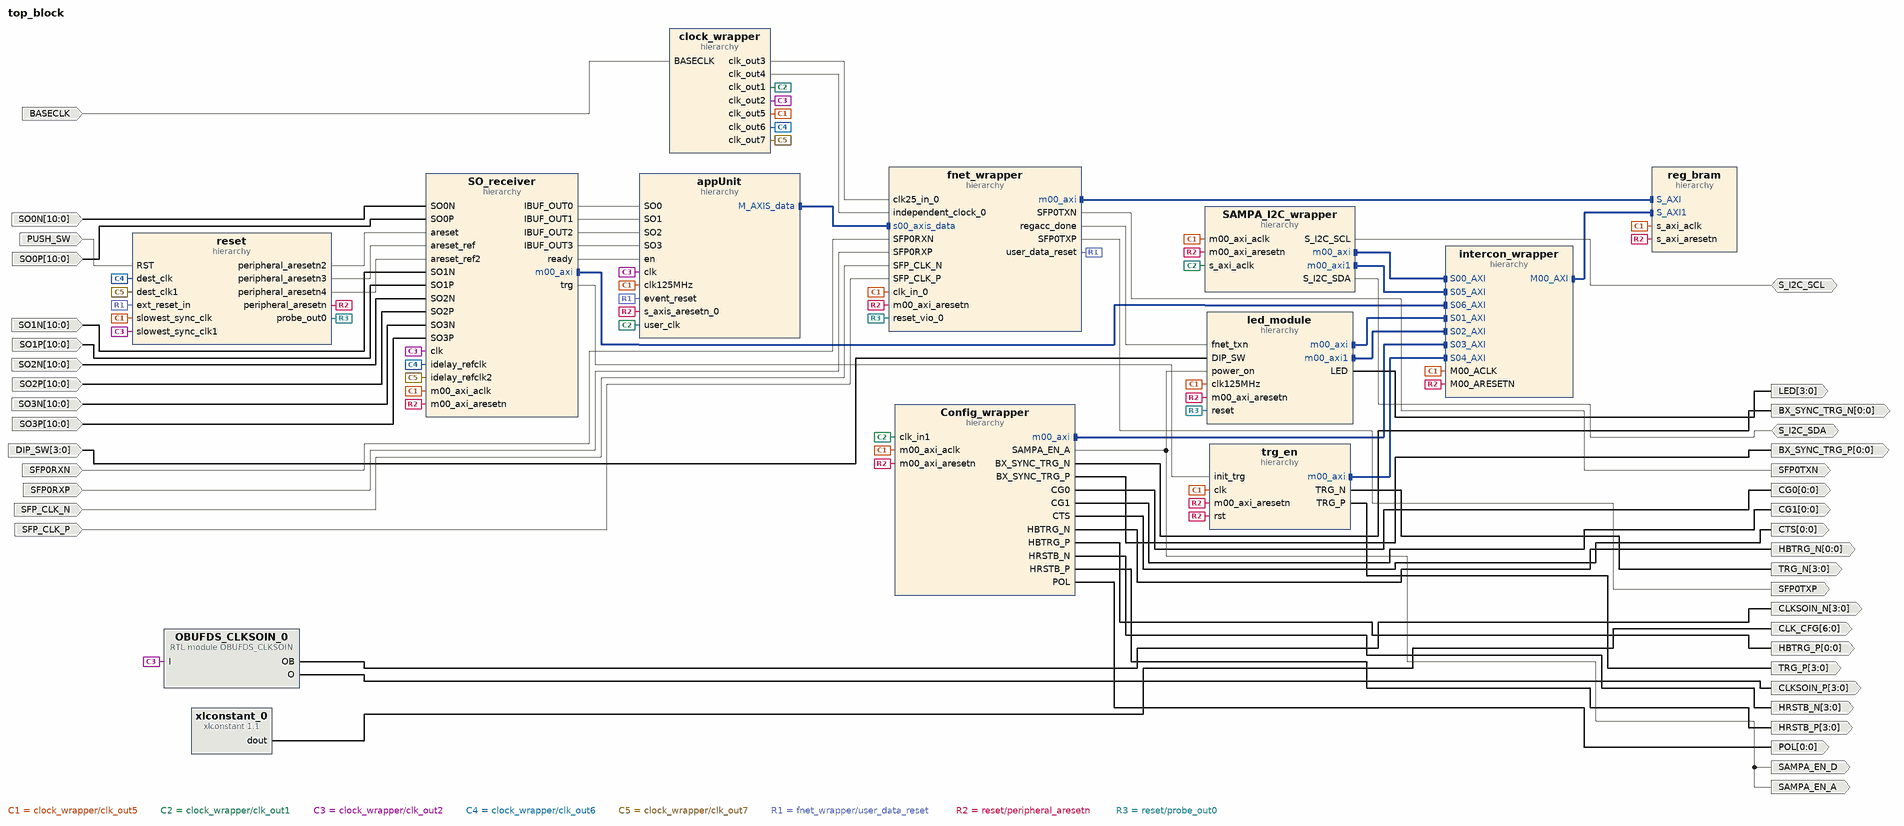
[diagram p0: block diagram of the top level]
# Vivado block design top_block, xcau15p-sbvb484-1-i, Vivado 2022.2
create_bd_design top_block

create_bd_port -dir I SFP0RXN
create_bd_port -dir O SFP0TXP
create_bd_port -dir I SFP_CLK_P
create_bd_port -dir I SFP_CLK_N
create_bd_port -dir O SFP0TXN
create_bd_port -dir I SFP0RXP
create_bd_port -dir I -type clk BASECLK
set_property -dict {CONFIG.FREQ_HZ 40000000} [get_bd_ports BASECLK]
create_bd_port -dir O -from 3 -to 0 LED
create_bd_port -dir I -from 10 -to 0 -type data SO1P
create_bd_port -dir I -from 10 -to 0 -type data SO1N
create_bd_port -dir I -from 10 -to 0 -type data SO0N
create_bd_port -dir I -from 10 -to 0 -type data SO0P
create_bd_port -dir I -from 10 -to 0 -type data SO2N
create_bd_port -dir I -from 10 -to 0 -type data SO2P
create_bd_port -dir I -from 10 -to 0 -type data SO3N
create_bd_port -dir I -from 10 -to 0 -type data SO3P
create_bd_port -dir O -from 3 -to 0 TRG_N
create_bd_port -dir O -from 3 -to 0 TRG_P
create_bd_port -dir O SAMPA_EN_A
create_bd_port -dir O SAMPA_EN_D
create_bd_port -dir O -from 6 -to 0 CLK_CFG
create_bd_port -dir O -from 3 -to 0 -type clk CLKSOIN_P
create_bd_port -dir O -from 3 -to 0 -type clk CLKSOIN_N
create_bd_port -dir I -type rst PUSH_SW
create_bd_port -dir IO S_I2C_SDA
create_bd_port -dir IO S_I2C_SCL
create_bd_port -dir O -from 0 -to 0 BX_SYNC_TRG_P
create_bd_port -dir O -from 0 -to 0 BX_SYNC_TRG_N
create_bd_port -dir O -from 0 -to 0 HBTRG_P
create_bd_port -dir O -from 0 -to 0 HBTRG_N
create_bd_port -dir O -from 3 -to 0 HRSTB_N
create_bd_port -dir O -from 3 -to 0 HRSTB_P
create_bd_port -dir O -from 0 -to 0 CTS
create_bd_port -dir O -from 0 -to 0 POL
create_bd_port -dir O -from 0 -to 0 CG0
create_bd_port -dir O -from 0 -to 0 CG1
create_bd_port -dir I -from 3 -to 0 DIP_SW

create_bd_cell -type hier led_module
create_bd_cell -type hier reset
create_bd_cell -type hier reg_bram
create_bd_cell -type hier SAMPA_I2C_wrapper
create_bd_cell -type ip -vlnv xilinx.com:ip:xlconstant:1.1 xlconstant_0
set_property -dict {CONFIG.CONST_VAL 0b1010011 CONFIG.CONST_WIDTH 7} [get_bd_cells xlconstant_0]
create_bd_cell -type hier appUnit
create_bd_cell -type hier fnet_wrapper
create_bd_cell -type hier clock_wrapper
create_bd_cell -type hier SO_receiver
create_bd_cell -type hier trg_en
create_bd_cell -type hier Config_wrapper
create_bd_cell -type hier intercon_wrapper
create_bd_cell -type module -reference OBUFDS_CLKSOIN OBUFDS_CLKSOIN_0

# ---- hierarchy /led_module ----
current_bd_instance /led_module
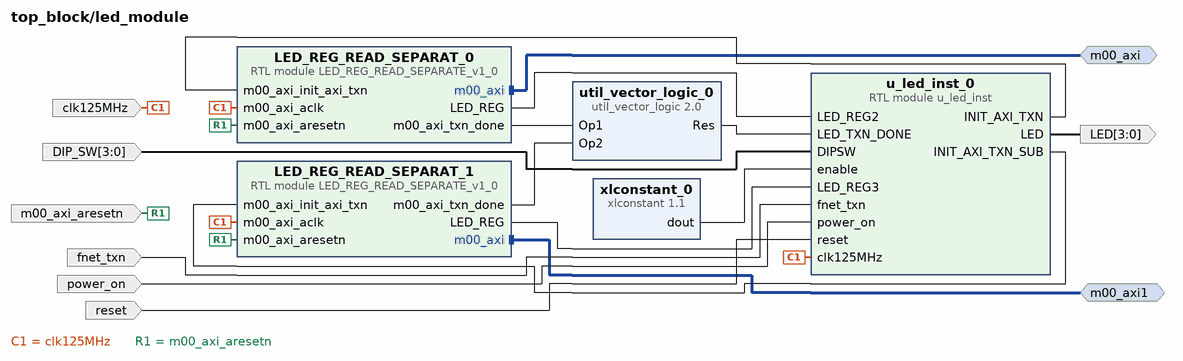
[diagram p1: block diagram inside /led_module]
create_bd_intf_pin -mode Master -vlnv xilinx.com:interface:aximm_rtl:1.0 m00_axi
create_bd_intf_pin -mode Master -vlnv xilinx.com:interface:aximm_rtl:1.0 m00_axi1
create_bd_pin -dir I -type rst reset
create_bd_pin -dir O -from 3 -to 0 LED
create_bd_pin -dir I clk125MHz
create_bd_pin -dir I -type rst m00_axi_aresetn
create_bd_pin -dir I fnet_txn
create_bd_pin -dir I power_on
create_bd_pin -dir I -from 3 -to 0 DIP_SW

create_bd_cell -type ip -vlnv xilinx.com:ip:util_vector_logic:2.0 util_vector_logic_0
set_property -dict {CONFIG.C_OPERATION or CONFIG.C_SIZE 1} [get_bd_cells util_vector_logic_0]
create_bd_cell -type ip -vlnv xilinx.com:ip:xlconstant:1.1 xlconstant_0
create_bd_cell -type module -reference LED_REG_READ_SEPARATE_v1_0 LED_REG_READ_SEPARAT_0
set_property -dict [list \
  CONFIG.C_M00_AXI_TARGET_SLAVE_BASE_ADDR 0xC0000000 \
  CONFIG.LED_ADDRESS 0x00000F02 \
] [get_bd_cells LED_REG_READ_SEPARAT_0]
create_bd_cell -type module -reference LED_REG_READ_SEPARATE_v1_0 LED_REG_READ_SEPARAT_1
set_property -dict [list \
  CONFIG.C_M00_AXI_TARGET_SLAVE_BASE_ADDR 0xC0000000 \
  CONFIG.LED_ADDRESS 0x00000F03 \
] [get_bd_cells LED_REG_READ_SEPARAT_1]
create_bd_cell -type module -reference u_led_inst u_led_inst_0

# ---- hierarchy /reset ----
current_bd_instance /reset
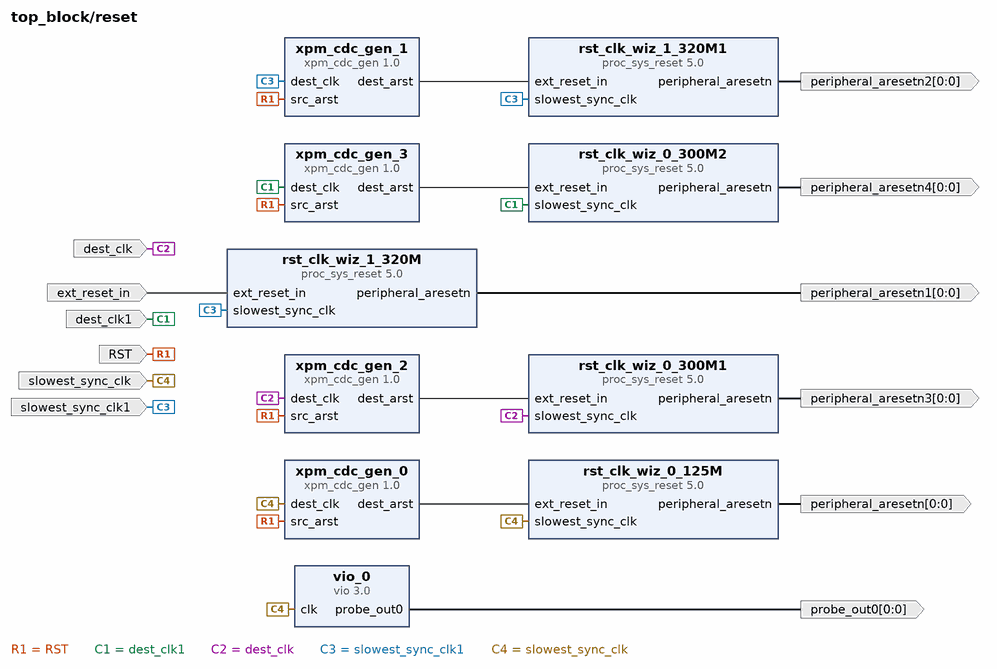
[diagram p2: block diagram inside /reset]
create_bd_pin -dir O -from 0 -to 0 probe_out0
create_bd_pin -dir I -type clk slowest_sync_clk
create_bd_pin -dir O -from 0 -to 0 -type rst peripheral_aresetn
create_bd_pin -dir I RST
create_bd_pin -dir I -type clk slowest_sync_clk1
create_bd_pin -dir O -from 0 -to 0 -type rst peripheral_aresetn1
create_bd_pin -dir I -type rst ext_reset_in
create_bd_pin -dir O -from 0 -to 0 -type rst peripheral_aresetn2
create_bd_pin -dir O -from 0 -to 0 -type rst peripheral_aresetn3
create_bd_pin -dir I -type clk dest_clk
create_bd_pin -dir I -type clk dest_clk1
create_bd_pin -dir O -from 0 -to 0 -type rst peripheral_aresetn4

create_bd_cell -type ip -vlnv xilinx.com:ip:vio:3.0 vio_0
set_property -dict {CONFIG.C_NUM_PROBE_IN 0} [get_bd_cells vio_0]
create_bd_cell -type ip -vlnv xilinx.com:ip:proc_sys_reset:5.0 rst_clk_wiz_0_125M
create_bd_cell -type ip -vlnv xilinx.com:ip:xpm_cdc_gen:1.0 xpm_cdc_gen_0
set_property -dict {CONFIG.CDC_TYPE xpm_cdc_async_rst CONFIG.DEST_SYNC_FF 8} [get_bd_cells xpm_cdc_gen_0]
create_bd_cell -type ip -vlnv xilinx.com:ip:proc_sys_reset:5.0 rst_clk_wiz_1_320M
create_bd_cell -type ip -vlnv xilinx.com:ip:proc_sys_reset:5.0 rst_clk_wiz_1_320M1
create_bd_cell -type ip -vlnv xilinx.com:ip:xpm_cdc_gen:1.0 xpm_cdc_gen_1
set_property -dict {CONFIG.CDC_TYPE xpm_cdc_async_rst} [get_bd_cells xpm_cdc_gen_1]
create_bd_cell -type ip -vlnv xilinx.com:ip:xpm_cdc_gen:1.0 xpm_cdc_gen_2
set_property -dict {CONFIG.CDC_TYPE xpm_cdc_async_rst CONFIG.DEST_SYNC_FF 8} [get_bd_cells xpm_cdc_gen_2]
create_bd_cell -type ip -vlnv xilinx.com:ip:proc_sys_reset:5.0 rst_clk_wiz_0_300M1
create_bd_cell -type ip -vlnv xilinx.com:ip:proc_sys_reset:5.0 rst_clk_wiz_0_300M2
create_bd_cell -type ip -vlnv xilinx.com:ip:xpm_cdc_gen:1.0 xpm_cdc_gen_3
set_property -dict {CONFIG.CDC_TYPE xpm_cdc_async_rst CONFIG.DEST_SYNC_FF 8} [get_bd_cells xpm_cdc_gen_3]

# ---- hierarchy /reg_bram ----
current_bd_instance /reg_bram
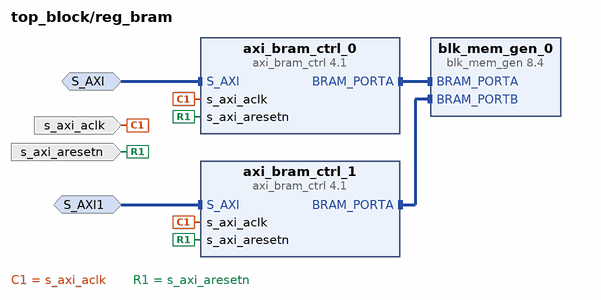
[diagram p3: block diagram inside /reg_bram]
create_bd_intf_pin -mode Slave -vlnv xilinx.com:interface:aximm_rtl:1.0 S_AXI
create_bd_intf_pin -mode Slave -vlnv xilinx.com:interface:aximm_rtl:1.0 S_AXI1
create_bd_pin -dir I -type rst s_axi_aresetn
create_bd_pin -dir I -type clk s_axi_aclk

create_bd_cell -type ip -vlnv xilinx.com:ip:axi_bram_ctrl:4.1 axi_bram_ctrl_0
set_property -dict {CONFIG.PROTOCOL AXI4LITE CONFIG.SINGLE_PORT_BRAM 1} [get_bd_cells axi_bram_ctrl_0]
create_bd_cell -type ip -vlnv xilinx.com:ip:blk_mem_gen:8.4 blk_mem_gen_0
set_property -dict {CONFIG.Memory_Type True_Dual_Port_RAM} [get_bd_cells blk_mem_gen_0]
create_bd_cell -type ip -vlnv xilinx.com:ip:axi_bram_ctrl:4.1 axi_bram_ctrl_1
set_property -dict {CONFIG.PROTOCOL AXI4LITE CONFIG.SINGLE_PORT_BRAM 1} [get_bd_cells axi_bram_ctrl_1]

# ---- hierarchy /SAMPA_I2C_wrapper ----
current_bd_instance /SAMPA_I2C_wrapper
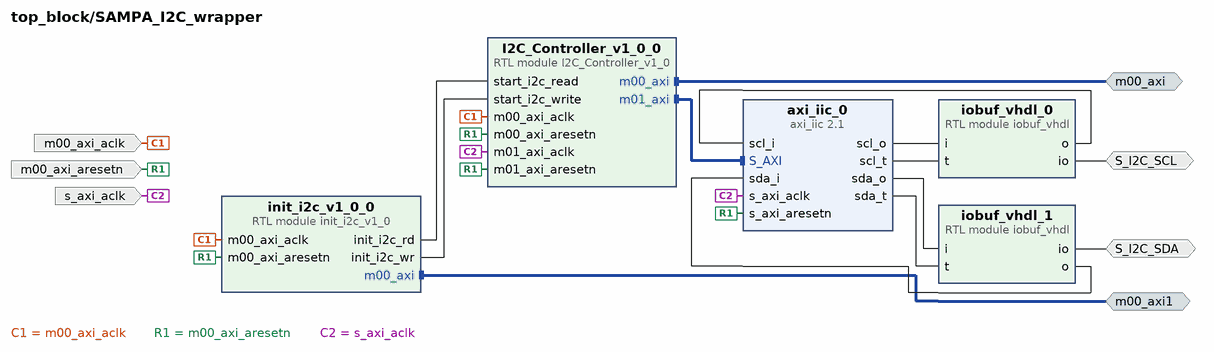
[diagram p4: block diagram inside /SAMPA_I2C_wrapper]
create_bd_intf_pin -mode Master -vlnv xilinx.com:interface:aximm_rtl:1.0 m00_axi
create_bd_intf_pin -mode Master -vlnv xilinx.com:interface:aximm_rtl:1.0 m00_axi1
create_bd_pin -dir I -type rst m00_axi_aresetn
create_bd_pin -dir I -type clk m00_axi_aclk
create_bd_pin -dir I -type clk s_axi_aclk
create_bd_pin -dir IO S_I2C_SDA
create_bd_pin -dir IO S_I2C_SCL

create_bd_cell -type ip -vlnv xilinx.com:ip:axi_iic:2.1 axi_iic_0
set_property -dict {CONFIG.C_SDA_LEVEL 0 CONFIG.IIC_FREQ_KHZ 1000 CONFIG.TEN_BIT_ADR 10_bit} [get_bd_cells axi_iic_0]
create_bd_cell -type module -reference iobuf_vhdl iobuf_vhdl_0
create_bd_cell -type module -reference iobuf_vhdl iobuf_vhdl_1
create_bd_cell -type module -reference I2C_Controller_v1_0 I2C_Controller_v1_0_0
set_property -dict [list \
  CONFIG.C_M00_AXI_TARGET_SLAVE_BASE_ADDR 0xC0000000 \
  CONFIG.C_M01_AXI_TARGET_SLAVE_BASE_ADDR 0x40000000 \
] [get_bd_cells I2C_Controller_v1_0_0]
create_bd_cell -type module -reference init_i2c_v1_0 init_i2c_v1_0_0
set_property -dict [list \
  CONFIG.C_M00_AXI_TARGET_SLAVE_BASE_ADDR 0xC0000000 \
  CONFIG.TARGET_ADDRESS 0x00000400 \
  CONFIG.TXN_TIMING 0x0100000 \
] [get_bd_cells init_i2c_v1_0_0]

# ---- hierarchy /appUnit ----
current_bd_instance /appUnit
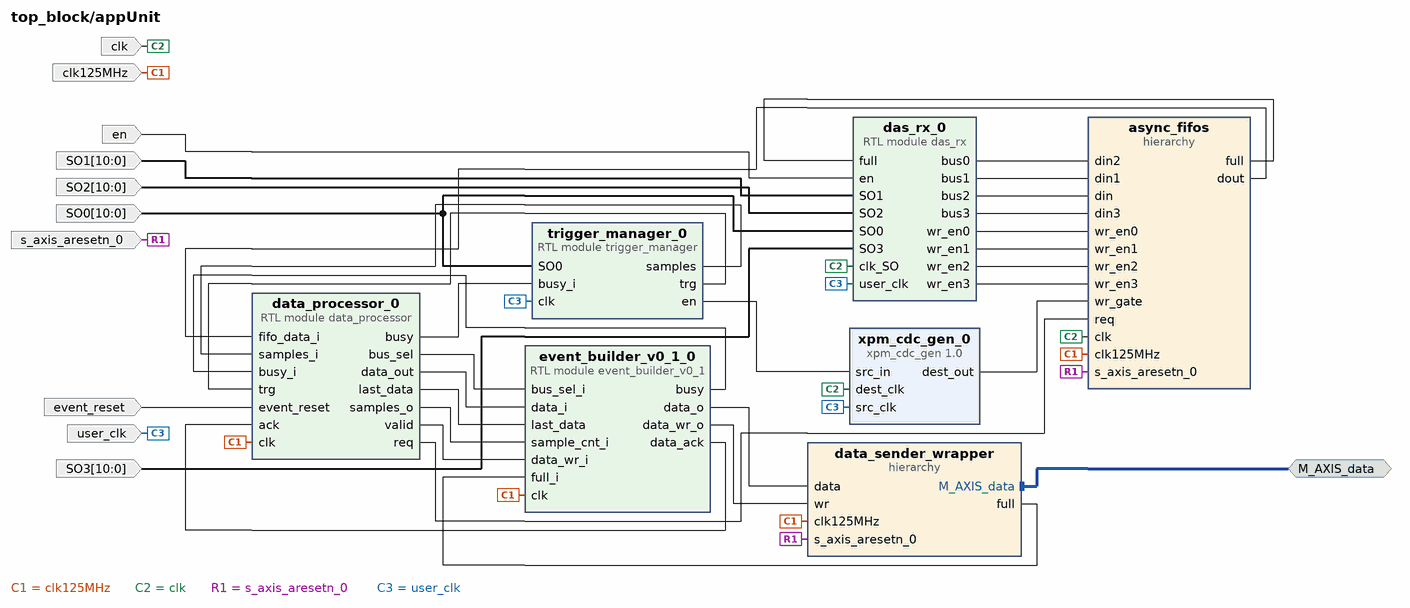
[diagram p5: block diagram inside /appUnit]
create_bd_intf_pin -mode Master -vlnv xilinx.com:interface:axis_rtl:1.0 M_AXIS_data
create_bd_pin -dir I -type clk clk
create_bd_pin -dir I -type clk user_clk
create_bd_pin -dir I -type rst event_reset
create_bd_pin -dir I -type clk clk125MHz
create_bd_pin -dir I -from 10 -to 0 SO1
create_bd_pin -dir I -from 10 -to 0 SO3
create_bd_pin -dir I -from 10 -to 0 SO2
create_bd_pin -dir I -from 10 -to 0 SO0
create_bd_pin -dir I en
create_bd_pin -dir I -type rst s_axis_aresetn_0

create_bd_cell -type ip -vlnv xilinx.com:ip:xpm_cdc_gen:1.0 xpm_cdc_gen_0
set_property -dict {CONFIG.CDC_TYPE xpm_cdc_single} [get_bd_cells xpm_cdc_gen_0]
create_bd_cell -type hier async_fifos
create_bd_cell -type hier data_sender_wrapper
create_bd_cell -type module -reference trigger_manager trigger_manager_0
create_bd_cell -type module -reference das_rx das_rx_0
create_bd_cell -type module -reference event_builder_v0_1 event_builder_v0_1_0
create_bd_cell -type module -reference data_processor data_processor_0

# ---- hierarchy /appUnit/async_fifos ----
current_bd_instance /appUnit/async_fifos
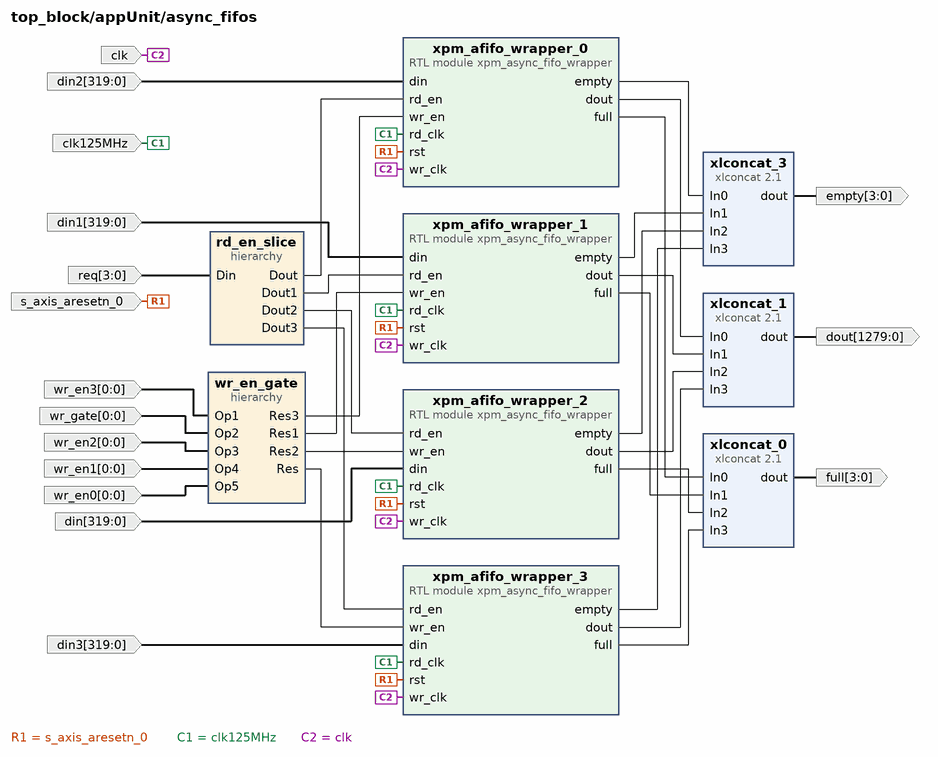
[diagram p6: block diagram inside /appUnit/async_fifos]
create_bd_pin -dir I -type clk clk125MHz
create_bd_pin -dir I -type clk clk
create_bd_pin -dir I -from 319 -to 0 din
create_bd_pin -dir I -from 319 -to 0 din1
create_bd_pin -dir I -from 319 -to 0 din2
create_bd_pin -dir I -from 319 -to 0 din3
create_bd_pin -dir O -from 1279 -to 0 dout
create_bd_pin -dir I -from 0 -to 0 wr_gate
create_bd_pin -dir I -from 0 -to 0 wr_en3
create_bd_pin -dir I -from 0 -to 0 wr_en2
create_bd_pin -dir I -from 0 -to 0 wr_en1
create_bd_pin -dir I -from 0 -to 0 wr_en0
create_bd_pin -dir I -from 3 -to 0 req
create_bd_pin -dir O -from 3 -to 0 empty
create_bd_pin -dir O -from 3 -to 0 full
create_bd_pin -dir I -type rst s_axis_aresetn_0

create_bd_cell -type ip -vlnv xilinx.com:ip:xlconcat:2.1 xlconcat_1
set_property -dict {CONFIG.NUM_PORTS 4} [get_bd_cells xlconcat_1]
create_bd_cell -type hier wr_en_gate
create_bd_cell -type hier rd_en_slice
create_bd_cell -type ip -vlnv xilinx.com:ip:xlconcat:2.1 xlconcat_3
set_property -dict {CONFIG.NUM_PORTS 4} [get_bd_cells xlconcat_3]
create_bd_cell -type ip -vlnv xilinx.com:ip:xlconcat:2.1 xlconcat_0
set_property -dict {CONFIG.NUM_PORTS 4} [get_bd_cells xlconcat_0]
create_bd_cell -type module -reference xpm_async_fifo_wrapper xpm_afifo_wrapper_1
create_bd_cell -type module -reference xpm_async_fifo_wrapper xpm_afifo_wrapper_2
create_bd_cell -type module -reference xpm_async_fifo_wrapper xpm_afifo_wrapper_3
create_bd_cell -type module -reference xpm_async_fifo_wrapper xpm_afifo_wrapper_0

# ---- hierarchy /appUnit/async_fifos/wr_en_gate ----
current_bd_instance /appUnit/async_fifos/wr_en_gate
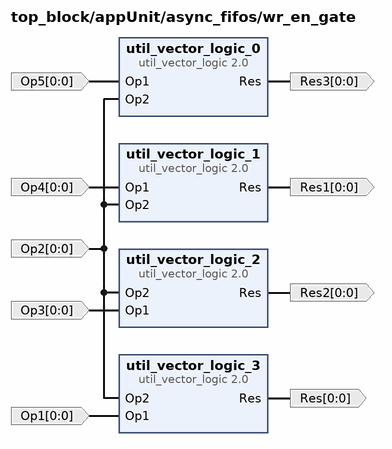
[diagram p7: block diagram inside /appUnit/async_fifos/wr_en_gate]
create_bd_pin -dir I -from 0 -to 0 Op2
create_bd_pin -dir I -from 0 -to 0 Op1
create_bd_pin -dir I -from 0 -to 0 Op3
create_bd_pin -dir I -from 0 -to 0 Op4
create_bd_pin -dir I -from 0 -to 0 Op5
create_bd_pin -dir O -from 0 -to 0 Res
create_bd_pin -dir O -from 0 -to 0 Res1
create_bd_pin -dir O -from 0 -to 0 Res2
create_bd_pin -dir O -from 0 -to 0 Res3

create_bd_cell -type ip -vlnv xilinx.com:ip:util_vector_logic:2.0 util_vector_logic_0
set_property -dict {CONFIG.C_OPERATION and CONFIG.C_SIZE 1} [get_bd_cells util_vector_logic_0]
create_bd_cell -type ip -vlnv xilinx.com:ip:util_vector_logic:2.0 util_vector_logic_1
set_property -dict {CONFIG.C_OPERATION and CONFIG.C_SIZE 1} [get_bd_cells util_vector_logic_1]
create_bd_cell -type ip -vlnv xilinx.com:ip:util_vector_logic:2.0 util_vector_logic_2
set_property -dict {CONFIG.C_OPERATION and CONFIG.C_SIZE 1} [get_bd_cells util_vector_logic_2]
create_bd_cell -type ip -vlnv xilinx.com:ip:util_vector_logic:2.0 util_vector_logic_3
set_property -dict {CONFIG.C_OPERATION and CONFIG.C_SIZE 1} [get_bd_cells util_vector_logic_3]

# ---- hierarchy /appUnit/async_fifos/rd_en_slice ----
current_bd_instance /appUnit/async_fifos/rd_en_slice
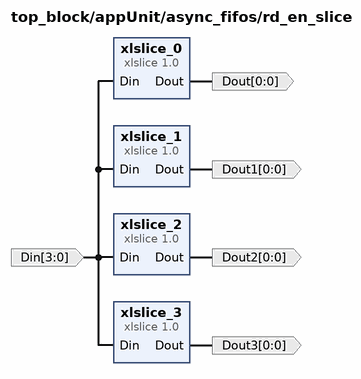
[diagram p8: block diagram inside /appUnit/async_fifos/rd_en_slice]
create_bd_pin -dir I -from 3 -to 0 Din
create_bd_pin -dir O -from 0 -to 0 Dout
create_bd_pin -dir O -from 0 -to 0 Dout1
create_bd_pin -dir O -from 0 -to 0 Dout2
create_bd_pin -dir O -from 0 -to 0 Dout3

create_bd_cell -type ip -vlnv xilinx.com:ip:xlslice:1.0 xlslice_1
set_property -dict {CONFIG.DIN_FROM 1 CONFIG.DIN_TO 1 CONFIG.DIN_WIDTH 4} [get_bd_cells xlslice_1]
create_bd_cell -type ip -vlnv xilinx.com:ip:xlslice:1.0 xlslice_2
set_property -dict {CONFIG.DIN_FROM 2 CONFIG.DIN_TO 2 CONFIG.DIN_WIDTH 4} [get_bd_cells xlslice_2]
create_bd_cell -type ip -vlnv xilinx.com:ip:xlslice:1.0 xlslice_3
set_property -dict {CONFIG.DIN_FROM 3 CONFIG.DIN_TO 3 CONFIG.DIN_WIDTH 4} [get_bd_cells xlslice_3]
create_bd_cell -type ip -vlnv xilinx.com:ip:xlslice:1.0 xlslice_0
set_property -dict {CONFIG.DIN_FROM 0 CONFIG.DIN_TO 0 CONFIG.DIN_WIDTH 4} [get_bd_cells xlslice_0]

# ---- hierarchy /appUnit/data_sender_wrapper ----
current_bd_instance /appUnit/data_sender_wrapper
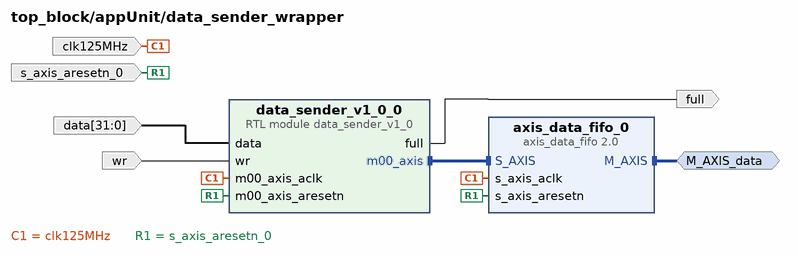
[diagram p9: block diagram inside /appUnit/data_sender_wrapper]
create_bd_intf_pin -mode Master -vlnv xilinx.com:interface:axis_rtl:1.0 M_AXIS_data
create_bd_pin -dir O full
create_bd_pin -dir I -from 31 -to 0 data
create_bd_pin -dir I wr
create_bd_pin -dir I -type clk clk125MHz
create_bd_pin -dir I -type rst s_axis_aresetn_0

create_bd_cell -type ip -vlnv xilinx.com:ip:axis_data_fifo:2.0 axis_data_fifo_0
set_property -dict {CONFIG.FIFO_DEPTH 32 CONFIG.FIFO_MEMORY_TYPE block CONFIG.FIFO_MODE 2} [get_bd_cells axis_data_fifo_0]
create_bd_cell -type module -reference data_sender_v1_0 data_sender_v1_0_0

# ---- hierarchy /fnet_wrapper ----
current_bd_instance /fnet_wrapper
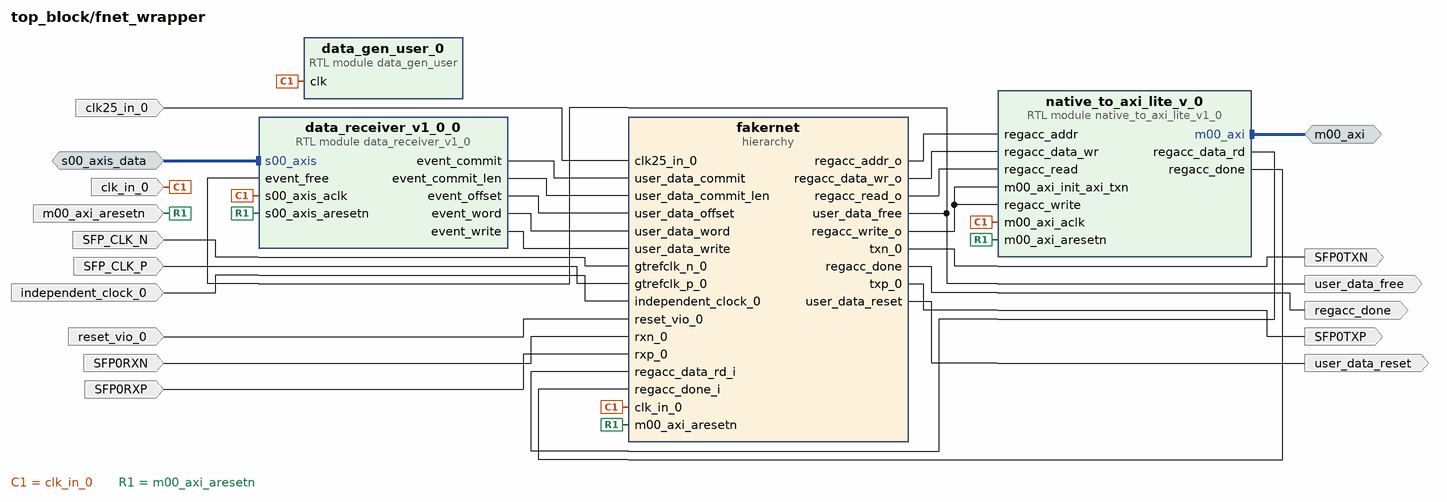
[diagram p10: block diagram inside /fnet_wrapper]
create_bd_intf_pin -mode Master -vlnv xilinx.com:interface:aximm_rtl:1.0 m00_axi
create_bd_intf_pin -mode Slave -vlnv xilinx.com:interface:axis_rtl:1.0 s00_axis_data
create_bd_pin -dir O -type rst user_data_reset
create_bd_pin -dir O user_data_free
create_bd_pin -dir I clk25_in_0
create_bd_pin -dir I -type clk independent_clock_0
create_bd_pin -dir I clk_in_0
create_bd_pin -dir O regacc_done
create_bd_pin -dir I -type rst reset_vio_0
create_bd_pin -dir I -type rst m00_axi_aresetn
create_bd_pin -dir I SFP0RXN
create_bd_pin -dir O SFP0TXP
create_bd_pin -dir I SFP_CLK_P
create_bd_pin -dir I SFP_CLK_N
create_bd_pin -dir O SFP0TXN
create_bd_pin -dir I SFP0RXP

create_bd_cell -type hier fakernet
create_bd_cell -type module -reference native_to_axi_lite_v1_0 native_to_axi_lite_v_0
set_property -dict {CONFIG.C_M00_AXI_TARGET_SLAVE_BASE_ADDR 0xC0000000} [get_bd_cells native_to_axi_lite_v_0]
create_bd_cell -type module -reference data_gen_user data_gen_user_0
create_bd_cell -type module -reference data_receiver_v1_0 data_receiver_v1_0_0

# ---- hierarchy /fnet_wrapper/fakernet ----
current_bd_instance /fnet_wrapper/fakernet
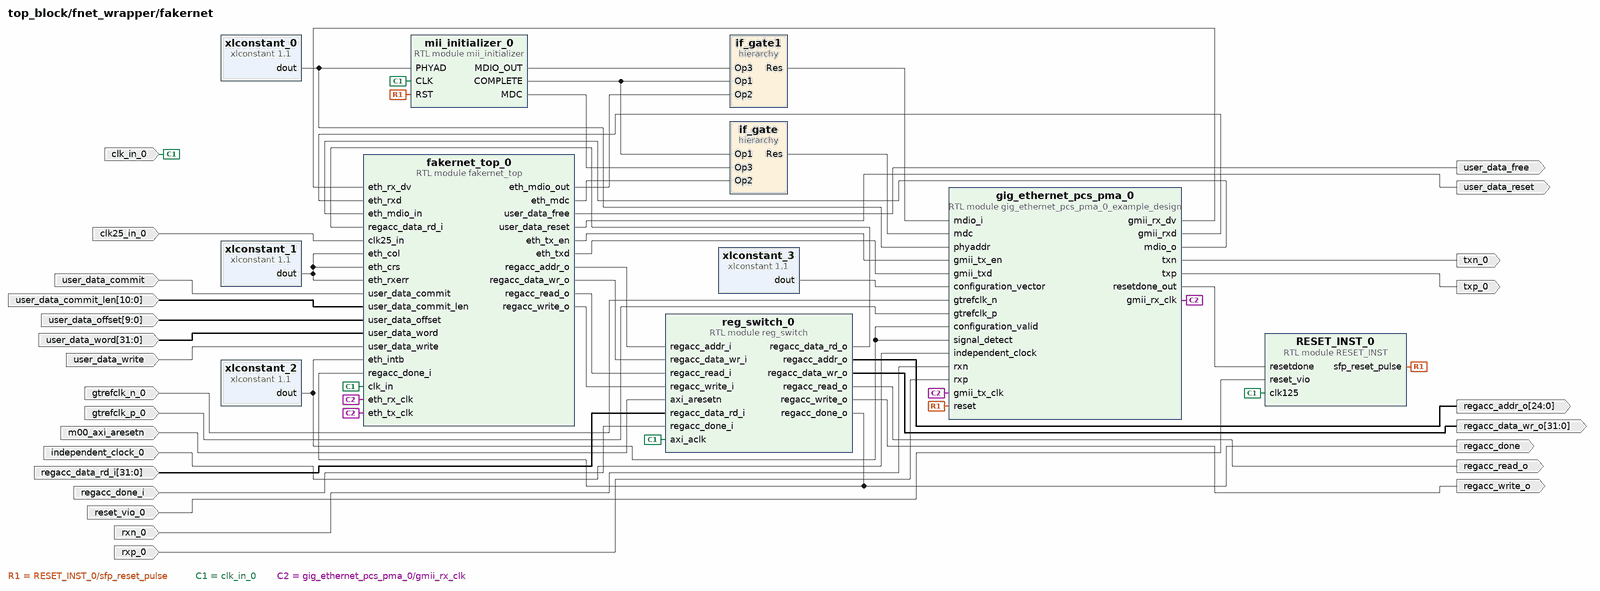
[diagram p11: block diagram inside /fnet_wrapper/fakernet]
create_bd_pin -dir I rxn_0
create_bd_pin -dir O txp_0
create_bd_pin -dir I gtrefclk_p_0
create_bd_pin -dir I gtrefclk_n_0
create_bd_pin -dir I -type clk independent_clock_0
create_bd_pin -dir O txn_0
create_bd_pin -dir I rxp_0
create_bd_pin -dir I clk25_in_0
create_bd_pin -dir I clk_in_0
create_bd_pin -dir I -type rst reset_vio_0
create_bd_pin -dir O -type rst user_data_reset
create_bd_pin -dir O user_data_free
create_bd_pin -dir I user_data_commit
create_bd_pin -dir I -from 10 -to 0 user_data_commit_len
create_bd_pin -dir I user_data_write
create_bd_pin -dir I -from 9 -to 0 user_data_offset
create_bd_pin -dir I -from 31 -to 0 user_data_word
create_bd_pin -dir I -type rst m00_axi_aresetn
create_bd_pin -dir O regacc_done
create_bd_pin -dir I -from 31 -to 0 regacc_data_rd_i
create_bd_pin -dir O -from 31 -to 0 regacc_data_wr_o
create_bd_pin -dir I regacc_done_i
create_bd_pin -dir O regacc_read_o
create_bd_pin -dir O -from 24 -to 0 regacc_addr_o
create_bd_pin -dir O regacc_write_o

create_bd_cell -type hier if_gate
create_bd_cell -type hier if_gate1
create_bd_cell -type ip -vlnv xilinx.com:ip:xlconstant:1.1 xlconstant_0
set_property -dict {CONFIG.CONST_VAL 1 CONFIG.CONST_WIDTH 5} [get_bd_cells xlconstant_0]
create_bd_cell -type ip -vlnv xilinx.com:ip:xlconstant:1.1 xlconstant_1
set_property -dict {CONFIG.CONST_VAL 0 CONFIG.CONST_WIDTH 1} [get_bd_cells xlconstant_1]
create_bd_cell -type ip -vlnv xilinx.com:ip:xlconstant:1.1 xlconstant_2
set_property -dict {CONFIG.CONST_VAL 1 CONFIG.CONST_WIDTH 1} [get_bd_cells xlconstant_2]
create_bd_cell -type ip -vlnv xilinx.com:ip:xlconstant:1.1 xlconstant_3
set_property -dict {CONFIG.CONST_VAL 0 CONFIG.CONST_WIDTH 5} [get_bd_cells xlconstant_3]
create_bd_cell -type module -reference RESET_INST RESET_INST_0
create_bd_cell -type module -reference reg_switch reg_switch_0
create_bd_cell -type module -reference mii_initializer mii_initializer_0
create_bd_cell -type module -reference gig_ethernet_pcs_pma_0_example_design gig_ethernet_pcs_pma_0
create_bd_cell -type module -reference fakernet_top fakernet_top_0

# ---- hierarchy /fnet_wrapper/fakernet/if_gate ----
current_bd_instance /fnet_wrapper/fakernet/if_gate
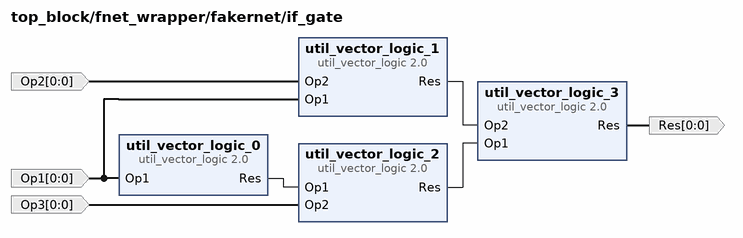
[diagram p12: block diagram inside /fnet_wrapper/fakernet/if_gate]
create_bd_pin -dir I -from 0 -to 0 Op1
create_bd_pin -dir I -from 0 -to 0 Op2
create_bd_pin -dir I -from 0 -to 0 Op3
create_bd_pin -dir O -from 0 -to 0 Res

create_bd_cell -type ip -vlnv xilinx.com:ip:util_vector_logic:2.0 util_vector_logic_0
set_property -dict {CONFIG.C_OPERATION not CONFIG.C_SIZE 1} [get_bd_cells util_vector_logic_0]
create_bd_cell -type ip -vlnv xilinx.com:ip:util_vector_logic:2.0 util_vector_logic_1
set_property -dict {CONFIG.C_SIZE 1} [get_bd_cells util_vector_logic_1]
create_bd_cell -type ip -vlnv xilinx.com:ip:util_vector_logic:2.0 util_vector_logic_2
set_property -dict {CONFIG.C_SIZE 1} [get_bd_cells util_vector_logic_2]
create_bd_cell -type ip -vlnv xilinx.com:ip:util_vector_logic:2.0 util_vector_logic_3
set_property -dict {CONFIG.C_OPERATION or CONFIG.C_SIZE 1} [get_bd_cells util_vector_logic_3]

# ---- hierarchy /fnet_wrapper/fakernet/if_gate1 ----
current_bd_instance /fnet_wrapper/fakernet/if_gate1
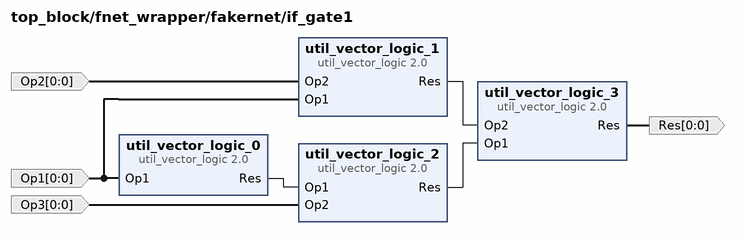
[diagram p13: block diagram inside /fnet_wrapper/fakernet/if_gate1]
create_bd_pin -dir I -from 0 -to 0 Op1
create_bd_pin -dir I -from 0 -to 0 Op2
create_bd_pin -dir I -from 0 -to 0 Op3
create_bd_pin -dir O -from 0 -to 0 Res

create_bd_cell -type ip -vlnv xilinx.com:ip:util_vector_logic:2.0 util_vector_logic_0
set_property -dict {CONFIG.C_OPERATION not CONFIG.C_SIZE 1} [get_bd_cells util_vector_logic_0]
create_bd_cell -type ip -vlnv xilinx.com:ip:util_vector_logic:2.0 util_vector_logic_1
set_property -dict {CONFIG.C_SIZE 1} [get_bd_cells util_vector_logic_1]
create_bd_cell -type ip -vlnv xilinx.com:ip:util_vector_logic:2.0 util_vector_logic_2
set_property -dict {CONFIG.C_SIZE 1} [get_bd_cells util_vector_logic_2]
create_bd_cell -type ip -vlnv xilinx.com:ip:util_vector_logic:2.0 util_vector_logic_3
set_property -dict {CONFIG.C_OPERATION or CONFIG.C_SIZE 1} [get_bd_cells util_vector_logic_3]

# ---- hierarchy /clock_wrapper ----
current_bd_instance /clock_wrapper
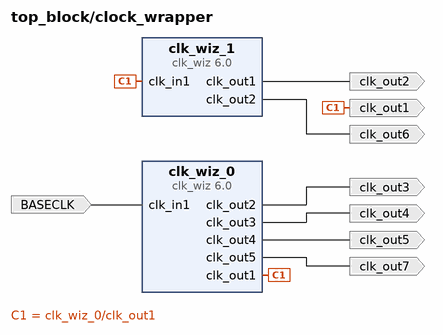
[diagram p14: block diagram inside /clock_wrapper]
create_bd_pin -dir O -type clk clk_out1
create_bd_pin -dir O -type clk clk_out3
create_bd_pin -dir O -type clk clk_out4
create_bd_pin -dir O -type clk clk_out5
create_bd_pin -dir I -type clk BASECLK
create_bd_pin -dir O -type clk clk_out2
create_bd_pin -dir O -type clk clk_out6
create_bd_pin -dir O -type clk clk_out7

create_bd_cell -type ip -vlnv xilinx.com:ip:clk_wiz:6.0 clk_wiz_1
set_property -dict [list \
  CONFIG.AUTO_PRIMITIVE MMCM \
  CONFIG.CLKIN1_JITTER_PS 250.0 \
  CONFIG.CLKOUT1_DRIVES Buffer \
  CONFIG.CLKOUT1_JITTER 128.655 \
  CONFIG.CLKOUT1_PHASE_ERROR 166.174 \
  CONFIG.CLKOUT1_REQUESTED_OUT_FREQ 320.000 \
  CONFIG.CLKOUT2_DRIVES Buffer \
  CONFIG.CLKOUT2_JITTER 129.867 \
  CONFIG.CLKOUT2_MATCHED_ROUTING false \
  CONFIG.CLKOUT2_PHASE_ERROR 166.174 \
  CONFIG.CLKOUT2_REQUESTED_OUT_FREQ 300 \
  CONFIG.CLKOUT2_USED true \
  CONFIG.CLKOUT3_DRIVES Buffer \
  CONFIG.CLKOUT3_JITTER 121.907 \
  CONFIG.CLKOUT3_PHASE_ERROR 154.081 \
  CONFIG.CLKOUT3_REQUESTED_OUT_FREQ 100.000 \
  CONFIG.CLKOUT3_USED false \
  CONFIG.CLKOUT4_DRIVES Buffer \
  CONFIG.CLKOUT5_DRIVES Buffer \
  CONFIG.CLKOUT6_DRIVES Buffer \
  CONFIG.CLKOUT7_DRIVES Buffer \
  CONFIG.ENABLE_CLOCK_MONITOR false \
  CONFIG.FEEDBACK_SOURCE FDBK_AUTO \
  CONFIG.MMCM_BANDWIDTH OPTIMIZED \
  CONFIG.MMCM_CLKFBOUT_MULT_F 30.000 \
  CONFIG.MMCM_CLKIN1_PERIOD 25.000 \
  CONFIG.MMCM_CLKIN2_PERIOD 10.0 \
  CONFIG.MMCM_CLKOUT0_DIVIDE_F 3.750 \
  CONFIG.MMCM_CLKOUT1_DIVIDE 4 \
  CONFIG.MMCM_CLKOUT2_DIVIDE 1 \
  CONFIG.MMCM_COMPENSATION AUTO \
  CONFIG.NUM_OUT_CLKS 2 \
  CONFIG.OPTIMIZE_CLOCKING_STRUCTURE_EN true \
  CONFIG.PRIMITIVE Auto \
  CONFIG.PRIM_IN_FREQ 40.000 \
  CONFIG.PRIM_SOURCE Global_buffer \
  CONFIG.USE_DYN_PHASE_SHIFT false \
  CONFIG.USE_LOCKED false \
  CONFIG.USE_POWER_DOWN false \
  CONFIG.USE_RESET false \
  CONFIG.USE_SAFE_CLOCK_STARTUP false \
] [get_bd_cells clk_wiz_1]
create_bd_cell -type ip -vlnv xilinx.com:ip:clk_wiz:6.0 clk_wiz_0
set_property -dict [list \
  CONFIG.AUTO_PRIMITIVE MMCM \
  CONFIG.CLKIN1_JITTER_PS 250.0 \
  CONFIG.CLKOUT1_DRIVES Buffer \
  CONFIG.CLKOUT1_JITTER 139.963 \
  CONFIG.CLKOUT1_PHASE_ERROR 137.290 \
  CONFIG.CLKOUT1_REQUESTED_OUT_FREQ 40.000 \
  CONFIG.CLKOUT2_DRIVES Buffer \
  CONFIG.CLKOUT2_JITTER 149.805 \
  CONFIG.CLKOUT2_PHASE_ERROR 137.290 \
  CONFIG.CLKOUT2_REQUESTED_OUT_FREQ 25 \
  CONFIG.CLKOUT2_USED true \
  CONFIG.CLKOUT3_DRIVES Buffer \
  CONFIG.CLKOUT3_JITTER 135.568 \
  CONFIG.CLKOUT3_PHASE_ERROR 137.290 \
  CONFIG.CLKOUT3_REQUESTED_OUT_FREQ 50 \
  CONFIG.CLKOUT3_USED true \
  CONFIG.CLKOUT4_DRIVES Buffer \
  CONFIG.CLKOUT4_JITTER 119.250 \
  CONFIG.CLKOUT4_PHASE_ERROR 137.290 \
  CONFIG.CLKOUT4_REQUESTED_OUT_FREQ 125 \
  CONFIG.CLKOUT4_USED true \
  CONFIG.CLKOUT5_DRIVES Buffer \
  CONFIG.CLKOUT5_JITTER 106.014 \
  CONFIG.CLKOUT5_PHASE_ERROR 137.290 \
  CONFIG.CLKOUT5_REQUESTED_OUT_FREQ 300 \
  CONFIG.CLKOUT5_USED true \
  CONFIG.CLKOUT6_DRIVES Buffer \
  CONFIG.CLKOUT6_JITTER 180.876 \
  CONFIG.CLKOUT6_PHASE_ERROR 191.950 \
  CONFIG.CLKOUT6_REQUESTED_OUT_FREQ 100.0 \
  CONFIG.CLKOUT6_USED false \
  CONFIG.CLKOUT7_DRIVES Buffer \
  CONFIG.FEEDBACK_SOURCE FDBK_AUTO \
  CONFIG.MMCM_BANDWIDTH OPTIMIZED \
  CONFIG.MMCM_CLKFBOUT_MULT_F 37.500 \
  CONFIG.MMCM_CLKIN1_PERIOD 25.000 \
  CONFIG.MMCM_CLKIN2_PERIOD 10.0 \
  CONFIG.MMCM_CLKOUT0_DIVIDE_F 37.500 \
  CONFIG.MMCM_CLKOUT1_DIVIDE 60 \
  CONFIG.MMCM_CLKOUT2_DIVIDE 30 \
  CONFIG.MMCM_CLKOUT3_DIVIDE 12 \
  CONFIG.MMCM_CLKOUT4_DIVIDE 5 \
  CONFIG.MMCM_CLKOUT5_DIVIDE 1 \
  CONFIG.MMCM_COMPENSATION AUTO \
  CONFIG.NUM_OUT_CLKS 5 \
  CONFIG.OPTIMIZE_CLOCKING_STRUCTURE_EN true \
  CONFIG.PRIMITIVE Auto \
  CONFIG.PRIM_IN_FREQ 40.000 \
  CONFIG.USE_LOCKED false \
  CONFIG.USE_RESET false \
] [get_bd_cells clk_wiz_0]

# ---- hierarchy /SO_receiver ----
current_bd_instance /SO_receiver
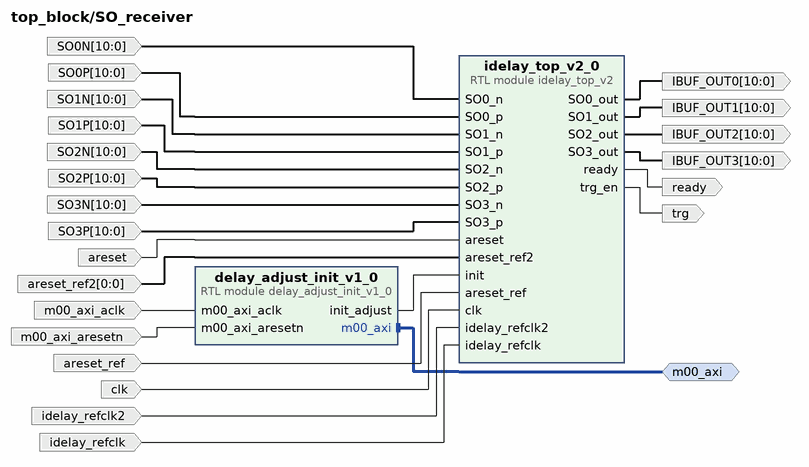
[diagram p15: block diagram inside /SO_receiver]
create_bd_intf_pin -mode Master -vlnv xilinx.com:interface:aximm_rtl:1.0 m00_axi
create_bd_pin -dir I -from 10 -to 0 -type clk SO1P
create_bd_pin -dir I -from 10 -to 0 -type clk SO1N
create_bd_pin -dir I -from 10 -to 0 -type clk SO0N
create_bd_pin -dir I -from 10 -to 0 -type clk SO0P
create_bd_pin -dir I -from 10 -to 0 -type clk SO2N
create_bd_pin -dir I -from 10 -to 0 -type clk SO2P
create_bd_pin -dir I -from 10 -to 0 -type clk SO3N
create_bd_pin -dir I -from 10 -to 0 -type clk SO3P
create_bd_pin -dir O -from 10 -to 0 IBUF_OUT1
create_bd_pin -dir O -from 10 -to 0 IBUF_OUT3
create_bd_pin -dir O -from 10 -to 0 IBUF_OUT2
create_bd_pin -dir O -from 10 -to 0 IBUF_OUT0
create_bd_pin -dir I -type clk clk
create_bd_pin -dir I -type clk idelay_refclk
create_bd_pin -dir O trg
create_bd_pin -dir I -type clk m00_axi_aclk
create_bd_pin -dir I -type rst m00_axi_aresetn
create_bd_pin -dir I areset
create_bd_pin -dir I areset_ref
create_bd_pin -dir I -from 0 -to 0 -type rst areset_ref2
create_bd_pin -dir I idelay_refclk2
create_bd_pin -dir O ready

create_bd_cell -type module -reference delay_adjust_init_v1_0 delay_adjust_init_v1_0
set_property -dict [list \
  CONFIG.C_M00_AXI_TARGET_SLAVE_BASE_ADDR 0xC0000000 \
  CONFIG.TARGET_ADDRESS 0x00001000 \
] [get_bd_cells delay_adjust_init_v1_0]
create_bd_cell -type module -reference idelay_top_v2 idelay_top_v2_0

# ---- hierarchy /trg_en ----
current_bd_instance /trg_en
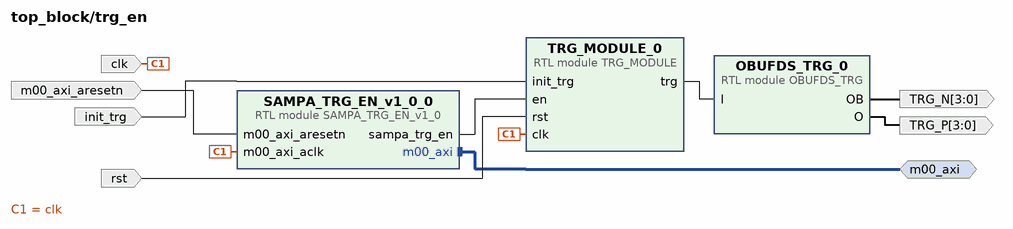
[diagram p16: block diagram inside /trg_en]
create_bd_intf_pin -mode Master -vlnv xilinx.com:interface:aximm_rtl:1.0 m00_axi
create_bd_pin -dir I -type rst rst
create_bd_pin -dir I init_trg
create_bd_pin -dir I -type clk clk
create_bd_pin -dir I -type rst m00_axi_aresetn
create_bd_pin -dir O -from 3 -to 0 -type clk TRG_N
create_bd_pin -dir O -from 3 -to 0 -type clk TRG_P

create_bd_cell -type module -reference OBUFDS_TRG OBUFDS_TRG_0
create_bd_cell -type module -reference SAMPA_TRG_EN_v1_0 SAMPA_TRG_EN_v1_0_0
set_property -dict [list \
  CONFIG.C_M00_AXI_TARGET_SLAVE_BASE_ADDR 0xC0000000 \
  CONFIG.TARGET_ADDRESS 0x00000500 \
  CONFIG.TXN_TIMING 0x0200000 \
] [get_bd_cells SAMPA_TRG_EN_v1_0_0]
create_bd_cell -type module -reference TRG_MODULE TRG_MODULE_0

# ---- hierarchy /Config_wrapper ----
current_bd_instance /Config_wrapper
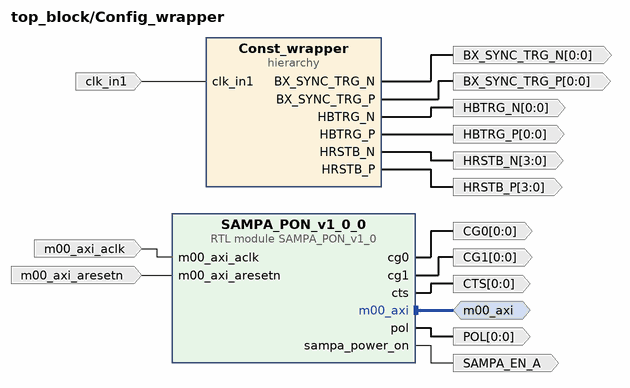
[diagram p17: block diagram inside /Config_wrapper]
create_bd_intf_pin -mode Master -vlnv xilinx.com:interface:aximm_rtl:1.0 m00_axi
create_bd_pin -dir O -from 0 -to 0 CG1
create_bd_pin -dir O -from 0 -to 0 CG0
create_bd_pin -dir O -from 0 -to 0 CTS
create_bd_pin -dir O -from 0 -to 0 POL
create_bd_pin -dir I -type rst m00_axi_aresetn
create_bd_pin -dir I -type clk m00_axi_aclk
create_bd_pin -dir O SAMPA_EN_A
create_bd_pin -dir I -type clk clk_in1
create_bd_pin -dir O -from 0 -to 0 -type clk BX_SYNC_TRG_P
create_bd_pin -dir O -from 0 -to 0 -type clk BX_SYNC_TRG_N
create_bd_pin -dir O -from 0 -to 0 -type clk HBTRG_P
create_bd_pin -dir O -from 0 -to 0 -type clk HBTRG_N
create_bd_pin -dir O -from 3 -to 0 -type clk HRSTB_N
create_bd_pin -dir O -from 3 -to 0 -type clk HRSTB_P

create_bd_cell -type hier Const_wrapper
create_bd_cell -type module -reference SAMPA_PON_v1_0 SAMPA_PON_v1_0_0
set_property -dict [list \
  CONFIG.C_M00_AXI_TARGET_SLAVE_BASE_ADDR 0xC0000000 \
  CONFIG.POWER_ON_ADDRESS 0x00000800 \
] [get_bd_cells SAMPA_PON_v1_0_0]

# ---- hierarchy /Config_wrapper/Const_wrapper ----
current_bd_instance /Config_wrapper/Const_wrapper
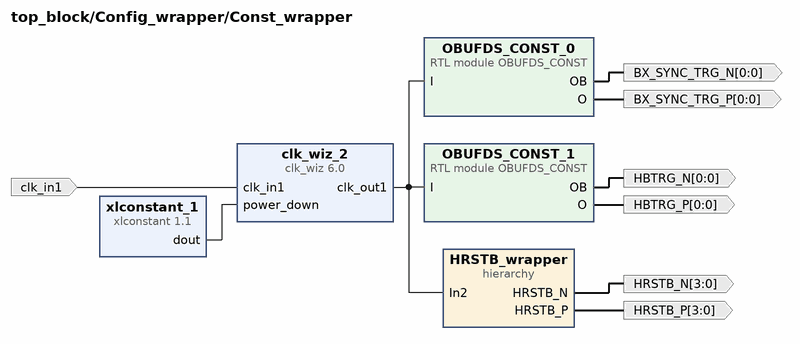
[diagram p18: block diagram inside /Config_wrapper/Const_wrapper]
create_bd_pin -dir I -type clk clk_in1
create_bd_pin -dir O -from 0 -to 0 -type clk BX_SYNC_TRG_P
create_bd_pin -dir O -from 0 -to 0 -type clk BX_SYNC_TRG_N
create_bd_pin -dir O -from 0 -to 0 -type clk HBTRG_P
create_bd_pin -dir O -from 0 -to 0 -type clk HBTRG_N
create_bd_pin -dir O -from 3 -to 0 -type clk HRSTB_N
create_bd_pin -dir O -from 3 -to 0 -type clk HRSTB_P

create_bd_cell -type ip -vlnv xilinx.com:ip:clk_wiz:6.0 clk_wiz_2
set_property -dict [list \
  CONFIG.AUTO_PRIMITIVE MMCM \
  CONFIG.CLKOUT1_DRIVES Buffer \
  CONFIG.CLKOUT1_JITTER 152.933 \
  CONFIG.CLKOUT1_PHASE_ERROR 166.174 \
  CONFIG.CLKOUT1_REQUESTED_OUT_FREQ 100 \
  CONFIG.CLKOUT2_DRIVES Buffer \
  CONFIG.CLKOUT3_DRIVES Buffer \
  CONFIG.CLKOUT4_DRIVES Buffer \
  CONFIG.CLKOUT5_DRIVES Buffer \
  CONFIG.CLKOUT6_DRIVES Buffer \
  CONFIG.CLKOUT7_DRIVES Buffer \
  CONFIG.FEEDBACK_SOURCE FDBK_AUTO \
  CONFIG.MMCM_BANDWIDTH OPTIMIZED \
  CONFIG.MMCM_CLKFBOUT_MULT_F 30.000 \
  CONFIG.MMCM_CLKOUT0_DIVIDE_F 12.000 \
  CONFIG.MMCM_COMPENSATION AUTO \
  CONFIG.OPTIMIZE_CLOCKING_STRUCTURE_EN true \
  CONFIG.PRIMITIVE Auto \
  CONFIG.USE_LOCKED false \
  CONFIG.USE_POWER_DOWN true \
  CONFIG.USE_RESET false \
] [get_bd_cells clk_wiz_2]
create_bd_cell -type ip -vlnv xilinx.com:ip:xlconstant:1.1 xlconstant_1
create_bd_cell -type hier HRSTB_wrapper
create_bd_cell -type module -reference OBUFDS_CONST OBUFDS_CONST_1
create_bd_cell -type module -reference OBUFDS_CONST OBUFDS_CONST_0

# ---- hierarchy /Config_wrapper/Const_wrapper/HRSTB_wrapper ----
current_bd_instance /Config_wrapper/Const_wrapper/HRSTB_wrapper
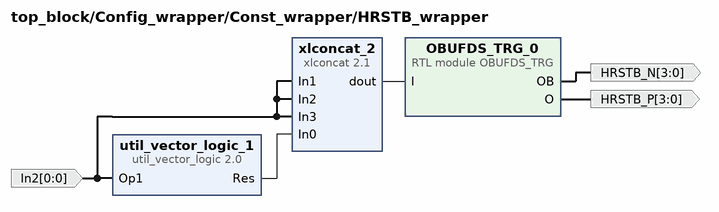
[diagram p19: block diagram inside /Config_wrapper/Const_wrapper/HRSTB_wrapper]
create_bd_pin -dir O -from 3 -to 0 -type clk HRSTB_N
create_bd_pin -dir O -from 3 -to 0 -type clk HRSTB_P
create_bd_pin -dir I -from 0 -to 0 In2

create_bd_cell -type ip -vlnv xilinx.com:ip:xlconcat:2.1 xlconcat_2
set_property -dict [list \
  CONFIG.IN0_WIDTH 1 \
  CONFIG.IN1_WIDTH 1 \
  CONFIG.IN2_WIDTH 1 \
  CONFIG.IN3_WIDTH 1 \
  CONFIG.NUM_PORTS 4 \
] [get_bd_cells xlconcat_2]
create_bd_cell -type ip -vlnv xilinx.com:ip:util_vector_logic:2.0 util_vector_logic_1
set_property -dict {CONFIG.C_OPERATION not CONFIG.C_SIZE 1} [get_bd_cells util_vector_logic_1]
create_bd_cell -type module -reference OBUFDS_TRG OBUFDS_TRG_0

# ---- hierarchy /intercon_wrapper ----
current_bd_instance /intercon_wrapper
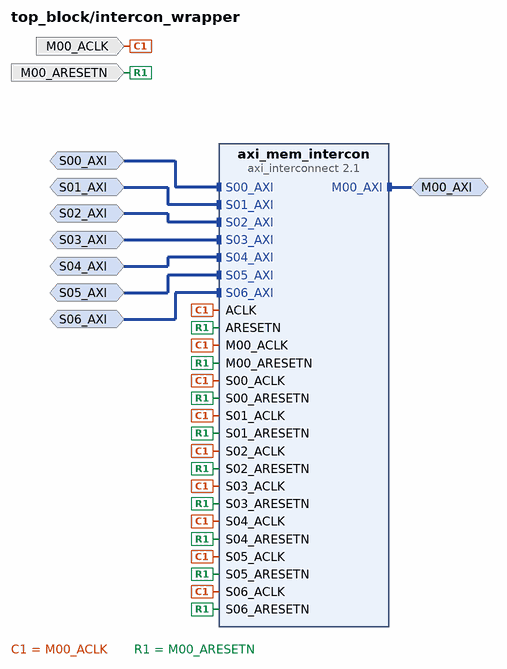
[diagram p20: block diagram inside /intercon_wrapper]
create_bd_intf_pin -mode Slave -vlnv xilinx.com:interface:aximm_rtl:1.0 S00_AXI
create_bd_intf_pin -mode Slave -vlnv xilinx.com:interface:aximm_rtl:1.0 S01_AXI
create_bd_intf_pin -mode Slave -vlnv xilinx.com:interface:aximm_rtl:1.0 S02_AXI
create_bd_intf_pin -mode Master -vlnv xilinx.com:interface:aximm_rtl:1.0 M00_AXI
create_bd_intf_pin -mode Slave -vlnv xilinx.com:interface:aximm_rtl:1.0 S03_AXI
create_bd_intf_pin -mode Slave -vlnv xilinx.com:interface:aximm_rtl:1.0 S04_AXI
create_bd_intf_pin -mode Slave -vlnv xilinx.com:interface:aximm_rtl:1.0 S05_AXI
create_bd_intf_pin -mode Slave -vlnv xilinx.com:interface:aximm_rtl:1.0 S06_AXI
create_bd_pin -dir I -type rst M00_ARESETN
create_bd_pin -dir I -type clk M00_ACLK

create_bd_cell -type ip -vlnv xilinx.com:ip:axi_interconnect:2.1 axi_mem_intercon
set_property -dict [list \
  CONFIG.M00_HAS_DATA_FIFO 1 \
  CONFIG.M00_HAS_REGSLICE 3 \
  CONFIG.NUM_MI 1 \
  CONFIG.NUM_SI 7 \
  CONFIG.S00_HAS_REGSLICE 3 \
  CONFIG.S01_HAS_REGSLICE 3 \
  CONFIG.S02_HAS_REGSLICE 3 \
  CONFIG.S03_HAS_REGSLICE 3 \
  CONFIG.S04_HAS_REGSLICE 3 \
  CONFIG.S05_HAS_REGSLICE 3 \
] [get_bd_cells axi_mem_intercon]

# ---- connections ----

current_bd_instance /led_module
connect_bd_intf_net [get_bd_intf_pins m00_axi] [get_bd_intf_pins LED_REG_READ_SEPARAT_0/m00_axi]
connect_bd_intf_net [get_bd_intf_pins m00_axi1] [get_bd_intf_pins LED_REG_READ_SEPARAT_1/m00_axi]
connect_bd_net [get_bd_pins DIP_SW] [get_bd_pins u_led_inst_0/DIPSW]
connect_bd_net [get_bd_pins LED_REG_READ_SEPARAT_0/LED_REG] [get_bd_pins u_led_inst_0/LED_REG2]
connect_bd_net [get_bd_pins LED_REG_READ_SEPARAT_0/m00_axi_txn_done] [get_bd_pins util_vector_logic_0/Op1]
connect_bd_net [get_bd_pins LED_REG_READ_SEPARAT_1/LED_REG] [get_bd_pins u_led_inst_0/LED_REG3]
connect_bd_net [get_bd_pins LED_REG_READ_SEPARAT_1/m00_axi_txn_done] [get_bd_pins util_vector_logic_0/Op2]
connect_bd_net [get_bd_pins clk125MHz] \
  [get_bd_pins LED_REG_READ_SEPARAT_0/m00_axi_aclk] [get_bd_pins LED_REG_READ_SEPARAT_1/m00_axi_aclk] \
  [get_bd_pins u_led_inst_0/clk125MHz]
connect_bd_net [get_bd_pins fnet_txn] [get_bd_pins u_led_inst_0/fnet_txn]
connect_bd_net [get_bd_pins m00_axi_aresetn] [get_bd_pins LED_REG_READ_SEPARAT_0/m00_axi_aresetn] [get_bd_pins LED_REG_READ_SEPARAT_1/m00_axi_aresetn]
connect_bd_net [get_bd_pins power_on] [get_bd_pins u_led_inst_0/power_on]
connect_bd_net [get_bd_pins reset] [get_bd_pins u_led_inst_0/reset]
connect_bd_net [get_bd_pins u_led_inst_0/INIT_AXI_TXN] [get_bd_pins LED_REG_READ_SEPARAT_0/m00_axi_init_axi_txn]
connect_bd_net [get_bd_pins u_led_inst_0/INIT_AXI_TXN_SUB] [get_bd_pins LED_REG_READ_SEPARAT_1/m00_axi_init_axi_txn]
connect_bd_net [get_bd_pins u_led_inst_0/LED] [get_bd_pins LED]
connect_bd_net [get_bd_pins util_vector_logic_0/Res] [get_bd_pins u_led_inst_0/LED_TXN_DONE]
connect_bd_net [get_bd_pins xlconstant_0/dout] [get_bd_pins u_led_inst_0/enable]

current_bd_instance /reset
connect_bd_net [get_bd_pins RST] \
  [get_bd_pins xpm_cdc_gen_0/src_arst] [get_bd_pins xpm_cdc_gen_1/src_arst] [get_bd_pins xpm_cdc_gen_2/src_arst] \
  [get_bd_pins xpm_cdc_gen_3/src_arst]
connect_bd_net -net dest_clk1_1 [get_bd_pins dest_clk1] [get_bd_pins xpm_cdc_gen_3/dest_clk] [get_bd_pins rst_clk_wiz_0_300M2/slowest_sync_clk]
connect_bd_net [get_bd_pins dest_clk] [get_bd_pins xpm_cdc_gen_2/dest_clk] [get_bd_pins rst_clk_wiz_0_300M1/slowest_sync_clk]
connect_bd_net [get_bd_pins ext_reset_in] [get_bd_pins rst_clk_wiz_1_320M/ext_reset_in]
connect_bd_net -net rst_clk_wiz_0_125M1_peripheral_aresetn [get_bd_pins rst_clk_wiz_0_300M1/peripheral_aresetn] [get_bd_pins peripheral_aresetn3]
connect_bd_net [get_bd_pins rst_clk_wiz_0_125M/peripheral_aresetn] [get_bd_pins peripheral_aresetn]
connect_bd_net [get_bd_pins rst_clk_wiz_0_300M2/peripheral_aresetn] [get_bd_pins peripheral_aresetn4]
connect_bd_net [get_bd_pins rst_clk_wiz_1_320M1/peripheral_aresetn] [get_bd_pins peripheral_aresetn2]
connect_bd_net [get_bd_pins rst_clk_wiz_1_320M/peripheral_aresetn] [get_bd_pins peripheral_aresetn1]
connect_bd_net -net slowest_sync_clk1_1 [get_bd_pins slowest_sync_clk1] \
  [get_bd_pins rst_clk_wiz_1_320M/slowest_sync_clk] [get_bd_pins xpm_cdc_gen_1/dest_clk] \
  [get_bd_pins rst_clk_wiz_1_320M1/slowest_sync_clk]
connect_bd_net [get_bd_pins slowest_sync_clk] \
  [get_bd_pins rst_clk_wiz_0_125M/slowest_sync_clk] [get_bd_pins vio_0/clk] [get_bd_pins xpm_cdc_gen_0/dest_clk]
connect_bd_net [get_bd_pins vio_0/probe_out0] [get_bd_pins probe_out0]
connect_bd_net [get_bd_pins xpm_cdc_gen_0/dest_arst] [get_bd_pins rst_clk_wiz_0_125M/ext_reset_in]
connect_bd_net [get_bd_pins xpm_cdc_gen_1/dest_arst] [get_bd_pins rst_clk_wiz_1_320M1/ext_reset_in]
connect_bd_net [get_bd_pins xpm_cdc_gen_2/dest_arst] [get_bd_pins rst_clk_wiz_0_300M1/ext_reset_in]
connect_bd_net [get_bd_pins xpm_cdc_gen_3/dest_arst] [get_bd_pins rst_clk_wiz_0_300M2/ext_reset_in]

current_bd_instance /reg_bram
connect_bd_intf_net [get_bd_intf_pins S_AXI] [get_bd_intf_pins axi_bram_ctrl_0/S_AXI]
connect_bd_intf_net [get_bd_intf_pins S_AXI1] [get_bd_intf_pins axi_bram_ctrl_1/S_AXI]
connect_bd_intf_net [get_bd_intf_pins axi_bram_ctrl_0/BRAM_PORTA] [get_bd_intf_pins blk_mem_gen_0/BRAM_PORTA]
connect_bd_intf_net [get_bd_intf_pins axi_bram_ctrl_1/BRAM_PORTA] [get_bd_intf_pins blk_mem_gen_0/BRAM_PORTB]
connect_bd_net [get_bd_pins s_axi_aclk] [get_bd_pins axi_bram_ctrl_1/s_axi_aclk] [get_bd_pins axi_bram_ctrl_0/s_axi_aclk]
connect_bd_net [get_bd_pins s_axi_aresetn] [get_bd_pins axi_bram_ctrl_1/s_axi_aresetn] [get_bd_pins axi_bram_ctrl_0/s_axi_aresetn]

current_bd_instance /SAMPA_I2C_wrapper
connect_bd_intf_net [get_bd_intf_pins m00_axi] [get_bd_intf_pins I2C_Controller_v1_0_0/m00_axi]
connect_bd_intf_net [get_bd_intf_pins axi_iic_0/S_AXI] [get_bd_intf_pins I2C_Controller_v1_0_0/m01_axi]
connect_bd_intf_net [get_bd_intf_pins m00_axi1] [get_bd_intf_pins init_i2c_v1_0_0/m00_axi]
connect_bd_net [get_bd_pins S_I2C_SDA] [get_bd_pins iobuf_vhdl_1/io]
connect_bd_net [get_bd_pins S_I2C_SCL] [get_bd_pins iobuf_vhdl_0/io]
connect_bd_net [get_bd_pins axi_iic_0/scl_o] [get_bd_pins iobuf_vhdl_0/i]
connect_bd_net [get_bd_pins axi_iic_0/scl_t] [get_bd_pins iobuf_vhdl_0/t]
connect_bd_net [get_bd_pins axi_iic_0/sda_o] [get_bd_pins iobuf_vhdl_1/i]
connect_bd_net [get_bd_pins axi_iic_0/sda_t] [get_bd_pins iobuf_vhdl_1/t]
connect_bd_net [get_bd_pins init_i2c_v1_0_0/init_i2c_rd] [get_bd_pins I2C_Controller_v1_0_0/start_i2c_read]
connect_bd_net [get_bd_pins init_i2c_v1_0_0/init_i2c_wr] [get_bd_pins I2C_Controller_v1_0_0/start_i2c_write]
connect_bd_net [get_bd_pins iobuf_vhdl_0/o] [get_bd_pins axi_iic_0/scl_i]
connect_bd_net [get_bd_pins iobuf_vhdl_1/o] [get_bd_pins axi_iic_0/sda_i]
connect_bd_net [get_bd_pins m00_axi_aclk] [get_bd_pins I2C_Controller_v1_0_0/m00_axi_aclk] [get_bd_pins init_i2c_v1_0_0/m00_axi_aclk]
connect_bd_net [get_bd_pins m00_axi_aresetn] \
  [get_bd_pins axi_iic_0/s_axi_aresetn] [get_bd_pins I2C_Controller_v1_0_0/m00_axi_aresetn] \
  [get_bd_pins I2C_Controller_v1_0_0/m01_axi_aresetn] [get_bd_pins init_i2c_v1_0_0/m00_axi_aresetn]
connect_bd_net [get_bd_pins s_axi_aclk] [get_bd_pins axi_iic_0/s_axi_aclk] [get_bd_pins I2C_Controller_v1_0_0/m01_axi_aclk]

current_bd_instance /appUnit
connect_bd_intf_net [get_bd_intf_pins M_AXIS_data] [get_bd_intf_pins data_sender_wrapper/M_AXIS_data]
connect_bd_net [get_bd_pins async_fifos/dout] [get_bd_pins data_processor_0/fifo_data_i]
connect_bd_net -net async_fifos_dout1 [get_bd_pins async_fifos/full] [get_bd_pins das_rx_0/full]
connect_bd_net -net clk1_1 [get_bd_pins clk125MHz] \
  [get_bd_pins async_fifos/clk125MHz] [get_bd_pins data_sender_wrapper/clk125MHz] [get_bd_pins event_builder_v0_1_0/clk] \
  [get_bd_pins data_processor_0/clk]
connect_bd_net [get_bd_pins clk] [get_bd_pins xpm_cdc_gen_0/dest_clk] [get_bd_pins async_fifos/clk] [get_bd_pins das_rx_0/clk_SO]
connect_bd_net [get_bd_pins das_rx_0/bus0] [get_bd_pins async_fifos/din2]
connect_bd_net [get_bd_pins das_rx_0/bus1] [get_bd_pins async_fifos/din1]
connect_bd_net [get_bd_pins das_rx_0/bus2] [get_bd_pins async_fifos/din]
connect_bd_net [get_bd_pins das_rx_0/bus3] [get_bd_pins async_fifos/din3]
connect_bd_net [get_bd_pins das_rx_0/wr_en0] [get_bd_pins async_fifos/wr_en0]
connect_bd_net [get_bd_pins das_rx_0/wr_en1] [get_bd_pins async_fifos/wr_en1]
connect_bd_net [get_bd_pins das_rx_0/wr_en2] [get_bd_pins async_fifos/wr_en2]
connect_bd_net [get_bd_pins das_rx_0/wr_en3] [get_bd_pins async_fifos/wr_en3]
connect_bd_net [get_bd_pins data_processor_0/bus_sel] [get_bd_pins event_builder_v0_1_0/bus_sel_i]
connect_bd_net [get_bd_pins data_processor_0/busy] [get_bd_pins trigger_manager_0/busy_i]
connect_bd_net -net data_processor_0_data_o [get_bd_pins data_processor_0/data_out] [get_bd_pins event_builder_v0_1_0/data_i]
connect_bd_net [get_bd_pins data_processor_0/last_data] [get_bd_pins event_builder_v0_1_0/last_data]
connect_bd_net [get_bd_pins data_processor_0/req] [get_bd_pins async_fifos/req]
connect_bd_net [get_bd_pins data_processor_0/samples_o] [get_bd_pins event_builder_v0_1_0/sample_cnt_i]
connect_bd_net [get_bd_pins data_processor_0/valid] [get_bd_pins event_builder_v0_1_0/data_wr_i]
connect_bd_net [get_bd_pins data_sender_wrapper/full] [get_bd_pins event_builder_v0_1_0/full_i]
connect_bd_net [get_bd_pins en] [get_bd_pins das_rx_0/en]
connect_bd_net [get_bd_pins event_builder_v0_1_0/busy] [get_bd_pins data_processor_0/busy_i]
connect_bd_net [get_bd_pins event_builder_v0_1_0/data_ack] [get_bd_pins data_processor_0/ack]
connect_bd_net [get_bd_pins event_builder_v0_1_0/data_o] [get_bd_pins data_sender_wrapper/data]
connect_bd_net [get_bd_pins event_builder_v0_1_0/data_wr_o] [get_bd_pins data_sender_wrapper/wr]
connect_bd_net [get_bd_pins event_reset] [get_bd_pins data_processor_0/event_reset]
connect_bd_net -net probe_in0_1 [get_bd_pins SO0] [get_bd_pins trigger_manager_0/SO0] [get_bd_pins das_rx_0/SO0]
connect_bd_net -net probe_in1_1 [get_bd_pins SO1] [get_bd_pins das_rx_0/SO1]
connect_bd_net -net probe_in2_1 [get_bd_pins SO2] [get_bd_pins das_rx_0/SO2]
connect_bd_net -net probe_in3_1 [get_bd_pins SO3] [get_bd_pins das_rx_0/SO3]
connect_bd_net -net s_axis_aresetn_0_1 [get_bd_pins s_axis_aresetn_0] \
  [get_bd_pins data_sender_wrapper/s_axis_aresetn_0] [get_bd_pins async_fifos/s_axis_aresetn_0]
connect_bd_net -net trigger_manager_0_busy [get_bd_pins trigger_manager_0/en] [get_bd_pins xpm_cdc_gen_0/src_in]
connect_bd_net [get_bd_pins trigger_manager_0/samples] [get_bd_pins data_processor_0/samples_i]
connect_bd_net [get_bd_pins trigger_manager_0/trg] [get_bd_pins data_processor_0/trg]
connect_bd_net [get_bd_pins user_clk] [get_bd_pins xpm_cdc_gen_0/src_clk] [get_bd_pins trigger_manager_0/clk] [get_bd_pins das_rx_0/user_clk]
connect_bd_net [get_bd_pins xpm_cdc_gen_0/dest_out] [get_bd_pins async_fifos/wr_gate]

current_bd_instance /appUnit/async_fifos
connect_bd_net -net Din_2 [get_bd_pins req] [get_bd_pins rd_en_slice/Din]
connect_bd_net [get_bd_pins s_axis_aresetn_0] \
  [get_bd_pins xpm_afifo_wrapper_1/rst] [get_bd_pins xpm_afifo_wrapper_2/rst] [get_bd_pins xpm_afifo_wrapper_3/rst] \
  [get_bd_pins xpm_afifo_wrapper_0/rst]
connect_bd_net -net Op1_1 [get_bd_pins wr_en3] [get_bd_pins wr_en_gate/Op1]
connect_bd_net -net Op2_1 [get_bd_pins wr_gate] [get_bd_pins wr_en_gate/Op2]
connect_bd_net -net Op3_1 [get_bd_pins wr_en2] [get_bd_pins wr_en_gate/Op3]
connect_bd_net -net Op4_1 [get_bd_pins wr_en1] [get_bd_pins wr_en_gate/Op4]
connect_bd_net -net Op5_1 [get_bd_pins wr_en0] [get_bd_pins wr_en_gate/Op5]
connect_bd_net [get_bd_pins clk125MHz] \
  [get_bd_pins xpm_afifo_wrapper_1/rd_clk] [get_bd_pins xpm_afifo_wrapper_2/rd_clk] [get_bd_pins xpm_afifo_wrapper_3/rd_clk] \
  [get_bd_pins xpm_afifo_wrapper_0/rd_clk]
connect_bd_net [get_bd_pins clk] \
  [get_bd_pins xpm_afifo_wrapper_1/wr_clk] [get_bd_pins xpm_afifo_wrapper_2/wr_clk] [get_bd_pins xpm_afifo_wrapper_3/wr_clk] \
  [get_bd_pins xpm_afifo_wrapper_0/wr_clk]
connect_bd_net -net din1_1 [get_bd_pins din1] [get_bd_pins xpm_afifo_wrapper_1/din]
connect_bd_net -net din2_1 [get_bd_pins din2] [get_bd_pins xpm_afifo_wrapper_0/din]
connect_bd_net -net din3_1 [get_bd_pins din3] [get_bd_pins xpm_afifo_wrapper_3/din]
connect_bd_net [get_bd_pins din] [get_bd_pins xpm_afifo_wrapper_2/din]
connect_bd_net [get_bd_pins rd_en_slice/Dout] [get_bd_pins xpm_afifo_wrapper_0/rd_en]
connect_bd_net [get_bd_pins rd_en_slice/Dout1] [get_bd_pins xpm_afifo_wrapper_1/rd_en]
connect_bd_net [get_bd_pins rd_en_slice/Dout2] [get_bd_pins xpm_afifo_wrapper_2/rd_en]
connect_bd_net [get_bd_pins rd_en_slice/Dout3] [get_bd_pins xpm_afifo_wrapper_3/rd_en]
connect_bd_net [get_bd_pins wr_en_gate/Res] [get_bd_pins xpm_afifo_wrapper_3/wr_en]
connect_bd_net [get_bd_pins wr_en_gate/Res1] [get_bd_pins xpm_afifo_wrapper_1/wr_en]
connect_bd_net [get_bd_pins wr_en_gate/Res2] [get_bd_pins xpm_afifo_wrapper_2/wr_en]
connect_bd_net [get_bd_pins wr_en_gate/Res3] [get_bd_pins xpm_afifo_wrapper_0/wr_en]
connect_bd_net [get_bd_pins xlconcat_0/dout] [get_bd_pins full]
connect_bd_net [get_bd_pins xlconcat_1/dout] [get_bd_pins dout]
connect_bd_net [get_bd_pins xlconcat_3/dout] [get_bd_pins empty]
connect_bd_net [get_bd_pins xpm_afifo_wrapper_0/dout] [get_bd_pins xlconcat_1/In0]
connect_bd_net [get_bd_pins xpm_afifo_wrapper_0/empty] [get_bd_pins xlconcat_3/In0]
connect_bd_net [get_bd_pins xpm_afifo_wrapper_0/full] [get_bd_pins xlconcat_0/In0]
connect_bd_net [get_bd_pins xpm_afifo_wrapper_1/dout] [get_bd_pins xlconcat_1/In1]
connect_bd_net [get_bd_pins xpm_afifo_wrapper_1/empty] [get_bd_pins xlconcat_3/In1]
connect_bd_net [get_bd_pins xpm_afifo_wrapper_1/full] [get_bd_pins xlconcat_0/In1]
connect_bd_net [get_bd_pins xpm_afifo_wrapper_2/dout] [get_bd_pins xlconcat_1/In2]
connect_bd_net [get_bd_pins xpm_afifo_wrapper_2/empty] [get_bd_pins xlconcat_3/In2]
connect_bd_net [get_bd_pins xpm_afifo_wrapper_2/full] [get_bd_pins xlconcat_0/In2]
connect_bd_net [get_bd_pins xpm_afifo_wrapper_3/dout] [get_bd_pins xlconcat_1/In3]
connect_bd_net [get_bd_pins xpm_afifo_wrapper_3/empty] [get_bd_pins xlconcat_3/In3]
connect_bd_net [get_bd_pins xpm_afifo_wrapper_3/full] [get_bd_pins xlconcat_0/In3]
